# Altium project MPCButton.PrjPcb
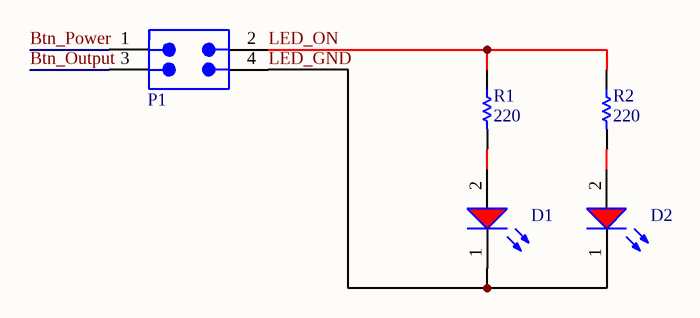
[diagram p0: MPCButton.SchDoc]
1 sheet, 5 parts. Net scope: global (net labels, ports and power ports of the same name join across sheets).
Board file: MPCButton.PcbDoc

## Sheet MPCButton.SchDoc
size A4; SheetNumber: 1; SheetTotal: 1; SPICEModelCacheOCTFYTSL: <root> / <DocumentId>OCTFYTSL</DocumentId> / <CacheFrame Number="0"> / <Model Name="0603_150060rs73220" Kind="CKT"> / <Text>****************************** / .subckt 0603_150060RS73220 1 2 / D1 1 2 SMCC / .MODEL SMCC D / + IS=153.31E-12 / + N=4.1406 / + RS=1.0267 / + CJO=1.0000E-12 / + M=.3333 / + VJ=.75 / + BV=5 / + IBV=100.00E-6 / + TT=5.0000E-9 / .ends</Text> / </Model> / </CacheFrame> / </root>

### Parts
D1  Red, 2V, 120°  [WL-SMCC_0603_150060xx73220]  (value not drawn)
D2  Red, 2V, 120°  [WL-SMCC_0603_150060xx73220]  (value not drawn)
P1  62100421921  [62100421921]  (value not drawn)
R1  220  [RESC0603(1608)_N]
R2  220  [RESC0603(1608)_N]

### Nets
Btn_Output: P1.3
Btn_Power: P1.1
LED_GND: D1.1(K) D2.1(K) P1.4
LED_ON: P1.2 R1.1 R2.1
NetD1_2: D1.2(A) R1.2
NetD2_2: D2.2(A) R2.2

### Library data of the parts
D1 D2 = 150060RS73220: WL-SMCC Mono-color Chip LED Compact, SMT, size 0603, Red, 2V, 120°; Manufacturer: Wurth Elektronik; Case/Size Code: 0603; Chip Technology: AlInGaP; Dominant Wavelength: 624nm; Luminous Intensity: 90mcd; Peak Wavelength: 632nm; Manufacturer Part Number: 150060RS73220; Category: Signal LEDs; Match Code: WL-SMCC; ComponentLink1Description: Website Link; ComponentLink1URL: https://www.we-online.com/redexpert/article/150060RS73220?ad; ComponentLink2Description: Datasheet Link; ComponentLink2URL: https://www.we-online.com/redexpert/spec/150060RS73220?ad; Mount: Surface Mount; Operating Temperature Max: 85°C; Operating Temperature Min: -40°C; Packaging: Tape and Reel; Length: 1.6mm; Width: 0.8mm; Height: 0.2mm; Emitting Color: Red; Forward Voltage: 2V; Viewing Angle: 120°
P1 = 62100421921: WR-PHD Pin Header, SMT, Vertical, pitch 2mm, 2 Row, 4P; Manufacturer: Wurth Elektronik; Contact Resistance: 20mOhm; Rated Current: 2A; Working Voltage: 200V; Withstanding Voltage: 500V; System: Connector; Manufacturer Part Number: 62100421921; Category: Board-to-Board Connectors; Match Code: WR-PHD; ComponentLink1Description: Website Link; ComponentLink1URL: https://www.we-online.com/redexpert/article/62100421921?ad; ComponentLink2Description: Datasheet Link; ComponentLink2URL: https://www.we-online.com/redexpert/spec/62100421921?ad; Mount: Surface Mount; Operating Temperature Max: 105°C; Operating Temperature Min: -40°C; Packaging: Tube; Gender: Pin Header; Number of Pins: 4; Number of Rows: 2; Orientation: Vertical; Pitch: 2mm
R1 R2 = RES